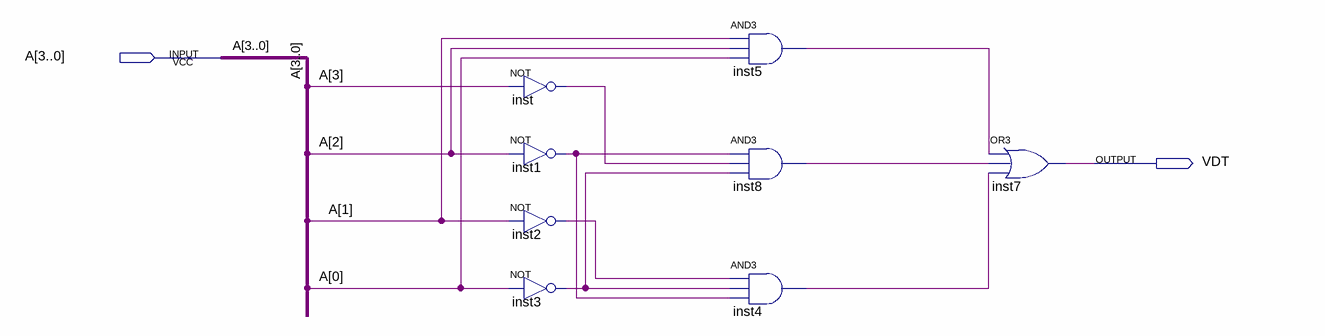
[diagram p0: schematic sheet]
// Quartus schematic assignment5_b.bdf as structural Verilog: 8 symbols, 2 pins
module assignment5_b (
  input  [3:0] A,
  output VDT
);

  wire inst1_out, inst2_out, inst3_out, inst4_out, inst5_out, inst8_out, inst_out;

  not inst (inst_out, A[3]);
  not inst1 (inst1_out, A[2]);
  not inst2 (inst2_out, A[1]);
  not inst3 (inst3_out, A[0]);
  and inst5 (inst5_out, A[1], A[2], A[0]);
  and inst8 (inst8_out, inst1_out, inst_out, inst3_out);
  and inst4 (inst4_out, inst2_out, inst3_out, inst1_out);
  or inst7 (VDT, inst5_out, inst8_out, inst4_out);
endmodule
